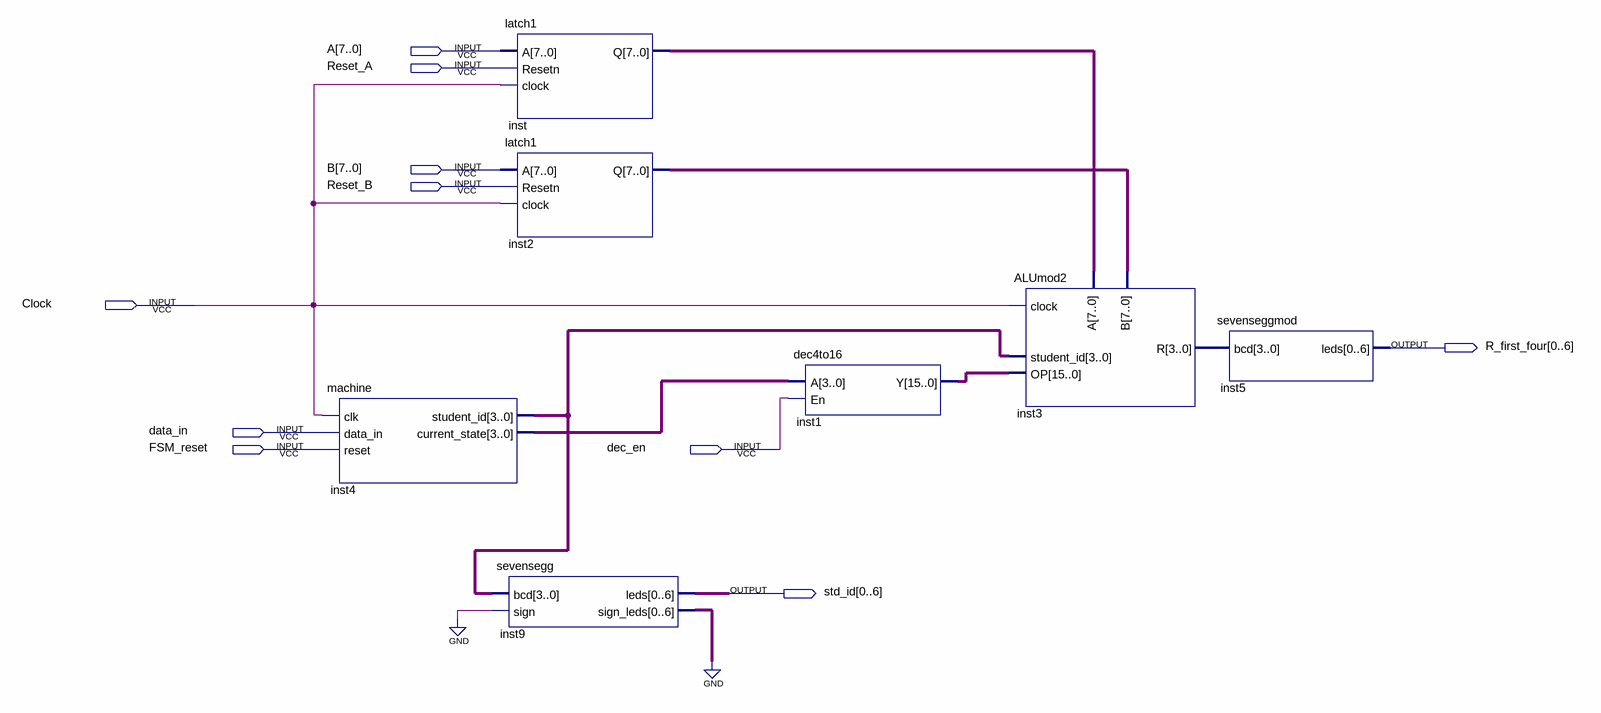
[diagram p0: schematic sheet]
// Quartus schematic finalproject3.bdf as structural Verilog: 7 symbols, 10 pins
module finalproject3 (
  input  [7:0] A,
  input  Reset_A,
  input  [7:0] B,
  input  Reset_B,
  input  Clock,
  input  data_in,
  input  FSM_reset,
  input  dec_en,
  output [0:6] R_first_four,
  output [0:6] std_id
);

  wire [3:0] inst3_r, inst4_current_state, inst4_student_id;
  wire [6:0] inst9_sign_leds;
  wire [7:0] inst2_q, inst_q;
  wire [15:0] inst1_y;

  machine inst4 (
    .clk(Clock), .data_in(data_in), .reset(FSM_reset), .student_id(inst4_student_id),
    .current_state(inst4_current_state));
  latch1 inst (.A(A), .Resetn(Reset_A), .clock(Clock), .Q(inst_q));
  latch1 inst2 (.A(B), .Resetn(Reset_B), .clock(Clock), .Q(inst2_q));
  sevensegg inst9 (.bcd(inst4_student_id), .sign(1'b0), .leds(std_id), .sign_leds(inst9_sign_leds));
  dec4to16 inst1 (.A(inst4_current_state), .En(dec_en), .Y(inst1_y));
  ALUmod2 inst3 (.clock(Clock), .A(inst_q), .B(inst2_q), .student_id(inst4_student_id), .OP(inst1_y), .R(inst3_r));
  sevenseggmod inst5 (.bcd(inst3_r), .leds(R_first_four));
  // also tied to GND on the sheet: {inst9_sign_leds[0], inst9_sign_leds[1], inst9_sign_leds[2], inst9_sign_leds[3], inst9_sign_leds[4], inst9_sign_leds[5], inst9_sign_leds[6]}
endmodule
